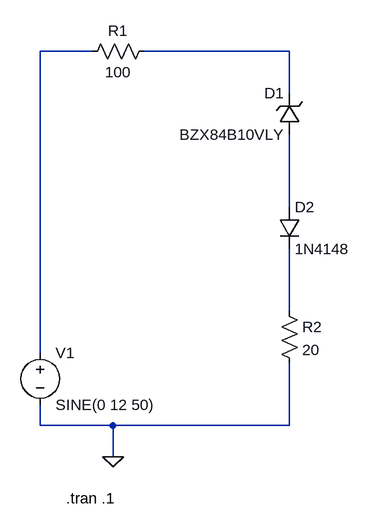
[diagram p0: schematic Zener2.asc]
Zener2.asc, the LTspice schematic file:
Version 4
SHEET 1 880 680
WIRE 96 -368 16 -368
WIRE 400 -368 176 -368
WIRE 400 -304 400 -368
WIRE 400 -128 400 -240
WIRE 400 32 400 -64
WIRE 16 96 16 -368
WIRE 16 208 16 176
WIRE 128 208 16 208
WIRE 400 208 400 112
WIRE 400 208 128 208
WIRE 128 256 128 208
FLAG 128 256 0
SYMBOL zener 416 -240 R180
WINDOW 0 24 64 Left 2
WINDOW 3 24 0 Left 2
SYMATTR InstName D1
SYMATTR Value BZX84B10VLY
SYMBOL voltage 16 80 R0
WINDOW 123 0 0 Left 0
WINDOW 39 0 0 Left 0
SYMATTR InstName V1
SYMATTR Value SINE(0 12 50)
SYMBOL res 192 -384 R90
WINDOW 0 0 56 VBottom 2
WINDOW 3 32 56 VTop 2
SYMATTR InstName R1
SYMATTR Value 100
SYMBOL res 384 16 R0
SYMATTR InstName R2
SYMATTR Value 20
SYMBOL diode 384 -128 R0
SYMATTR InstName D2
SYMATTR Value 1N4148
TEXT 56 320 Left 2 !.tran .1

The netlist it stands for:
* Zener2.asc
D1 N003 N002 BZX84B10VLY
V1 N001 0 SINE(0 12 50)
R1 N002 N001 100
R2 N004 0 20
D2 N003 N004 1N4148
.model D D
.lib standard.dio
.tran .1
.backanno
.end